# Altium schematic sheet Piezo Driver_ASCII.SchDoc: Piezo driver
size A4; DrawnBy: Daniel Berard; Engineer: Daniel Berard; DocumentNumber: 3; Revision: 1; SheetNumber: 3; SheetTotal: 4; ProjectName: STM
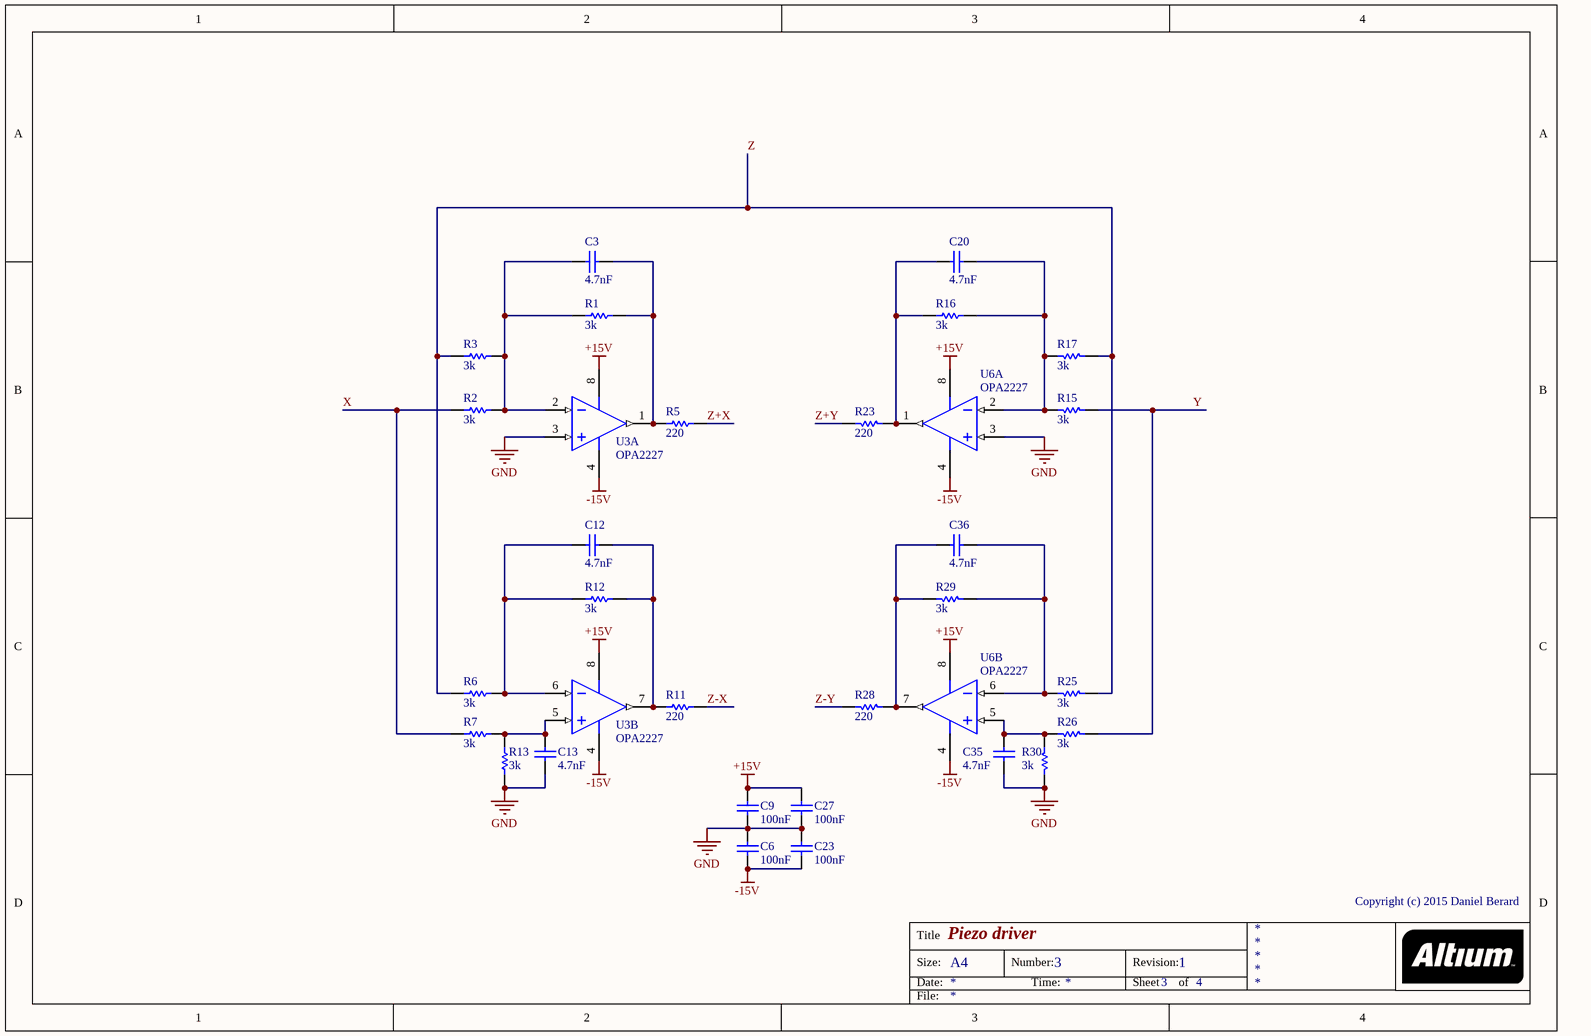
[diagram p0: Piezo Driver_ASCII.SchDoc]

## Parts
C3  4.7nF  [6-0805_N]
C6  100nF  [6-0805_N]
C9  100nF  [6-0805_N]
C12  4.7nF  [6-0805_N]
C13  4.7nF  [6-0805_N]
C20  4.7nF  [6-0805_N]
C23  100nF  [6-0805_N]
C27  100nF  [6-0805_N]
C35  4.7nF  [6-0805_N]
C36  4.7nF  [6-0805_N]
R1  3k  [6-0805_N]
R2  3k  [6-0805_N]
R3  3k  [6-0805_N]
R5  220  [6-0805_N]
R6  3k  [6-0805_N]
R7  3k  [6-0805_N]
R11  220  [6-0805_N]
R12  3k  [6-0805_N]
R13  3k  [6-0805_N]
R15  3k  [6-0805_N]
R16  3k  [6-0805_N]
R17  3k  [6-0805_N]
R23  220  [6-0805_N]
R25  3k  [6-0805_N]
R26  3k  [6-0805_N]
R28  220  [6-0805_N]
R29  3k  [6-0805_N]
R30  3k  [6-0805_N]
U3  OPA2227  [ADI-R-8_M]  (parts A,B of 2)
U6  OPA2227  [ADI-R-8_M]  (parts A,B of 2)

## Nets
+15V: C9.2 C27.2 U3.8(+V) U6.8(+V)
-15V: C6.1 C23.1 U3.4(-V) U6.4(-V)
GND: C6.2 C9.1 C13.1 C23.2 C27.1 C35.1 R13.1 R30.1 U3.3(+IN_A) U6.3(+IN_A)
X: R2.1 R7.1
Y: R15.1 R26.1
Z: R3.1 R6.1 R17.1 R25.1
Z+X: R5.2
Z+Y: R23.2
Z-X: R11.2
Z-Y: R28.2
NetC3_1: C3.1 R1.1 R2.2 R3.2 U3.2(-IN_A)
NetC3_2: C3.2 R1.2 R5.1 U3.1(OUT_A)
NetC12_1: C12.1 R6.2 R12.1 U3.6(-IN_B)
NetC12_2: C12.2 R11.1 R12.2 U3.7(OUT_B)
NetC13_2: C13.2 R7.2 R13.2 U3.5(+IN_B)
NetC20_1: C20.1 R16.1 R23.1 U6.1(OUT_A)
NetC20_2: C20.2 R15.2 R16.2 R17.2 U6.2(-IN_A)
NetC35_2: C35.2 R26.2 R30.2 U6.5(+IN_B)
NetC36_1: C36.1 R28.1 R29.2 U6.7(OUT_B)
NetC36_2: C36.2 R25.2 R29.1 U6.6(-IN_B)

## Notes on the sheet
- Copyright (c) 2015 Daniel Berard
- Title
- Size:
- Date:
- A4
- Number:
- Time:
- Revision:
- Sheet
- of
- File:

## Library data of the parts
C3 C6 C9 C12 C13 C20 C23 C27 C35 C36 = Cap: Capacitor; Value: 100pF; Published: 8-Jun-2000; LatestRevisionDate: 17-Jul-2002; LatestRevisionNote: Re-released for DXP Platform.; PackageReference: RAD-0.3; Publisher: Altium Limited; PackageDescription: Radial Cap, Thru-Hole; 2 Leads; 0.3 in Pin Spacing
R1-R3 R5-R7 R11-R13 R15-R17 R23 R25 R26 R28-R30 = Res1: Resistor; Value: 1K; Published: 8-Jun-2000; LatestRevisionDate: 17-Jul-2002; LatestRevisionNote: Re-released for DXP Platform.; PackageReference: AXIAL-0.3; Publisher: Altium Limited; PackageDescription: Axial Device, Thru-Hole; 2 Leads; 0.3 in Pin Spacing
U3 U6 = CMP-0384-01147-2: Double Channel Wide Bandwidth Operational Amplifier, 10 MHz BW, 2.5 V/us SR, Industrial, 8-pin SOIC (R-8), Tube; Manufacturer: Analog Devices; Generic Part Number: AD8676; PartNumber: AD8676BRZ; V Span Min: 10V; Input Offset Voltage: 12uV; V Span Max: 36V; Iq/Amp: 2.7mA; Input Bias Current: 2.4nA; Small Signal Bandwidth: 10MHz; Amplifiers Per Package: 2; ComponentLink2Description: Datasheet; RevisionNote: Reference Circuit URL fixed; ComponentLink4URL: http://www.analog.com/en/all-operational-amplifiers-op-amps/operational-amplifiers-op-amps/ad8676/products/product.html#product-recommendations; Code_JEDEC: MS-012-AA; PackageDescription: 8-Pin Standard Small Outline Package, Body 3.9 x 4.9 mm, Pitch 1.27 mm; Mounting Technology: Surface Mount; Slew Rate: 2.5V/us; ComponentLink4Description: Reference Circuit; PackageVersion: 060506-A; ComponentLink1URL: http://www.analog.com/en/index.html; ComponentLink2URL: http://www.analog.com/static/imported-files/data_sheets/AD8676.pdf; ComponentLink1Description: Manufacturer URL; ComponentLink3Description: Package Specification; DatasheetVersion: Rev. C; ComponentLink3URL: http://www.analog.com/static/imported-files/packages/PKG_PDF/SOIC_Narrow%20(R)/R_8.pdf; PackageReference: R-8